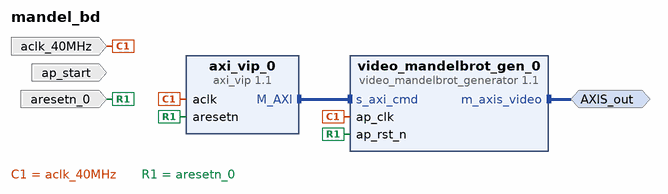
[diagram p0: block diagram of the top level]
# Vivado block design mandel_bd, xc7a35tcpg236-1, Vivado 2019.1
create_bd_design mandel_bd

create_bd_intf_port -mode Master -vlnv xilinx.com:interface:axis_rtl:1.0 AXIS_out
set_property -dict {CONFIG.FREQ_HZ 40000000} [get_bd_intf_ports AXIS_out]
create_bd_port -dir I -type clk aclk_40MHz
set_property -dict [list \
  CONFIG.ASSOCIATED_BUSIF AXIS_out \
  CONFIG.ASSOCIATED_RESET aresetn_0 \
  CONFIG.FREQ_HZ 40000000 \
] [get_bd_ports aclk_40MHz]
create_bd_port -dir I ap_start
create_bd_port -dir I -type rst aresetn_0

create_bd_cell -type ip -vlnv xilinx.com:ip:axi_vip:1.1 axi_vip_0
set_property -dict [list \
  CONFIG.ADDR_WIDTH 12 \
  CONFIG.DATA_WIDTH 32 \
  CONFIG.HAS_BRESP 1 \
  CONFIG.HAS_PROT 1 \
  CONFIG.HAS_RRESP 1 \
  CONFIG.HAS_WSTRB 1 \
  CONFIG.INTERFACE_MODE MASTER \
  CONFIG.PROTOCOL AXI4LITE \
  CONFIG.READ_WRITE_MODE READ_WRITE \
] [get_bd_cells axi_vip_0]
create_bd_cell -type ip -vlnv xilinx.com:hls:video_mandelbrot_generator:1.1 video_mandelbrot_gen_0

# ---- connections ----

connect_bd_intf_net [get_bd_intf_pins axi_vip_0/M_AXI] [get_bd_intf_pins video_mandelbrot_gen_0/s_axi_cmd]
connect_bd_intf_net [get_bd_intf_ports AXIS_out] [get_bd_intf_pins video_mandelbrot_gen_0/m_axis_video]
connect_bd_net [get_bd_ports aclk_40MHz] [get_bd_pins video_mandelbrot_gen_0/ap_clk] [get_bd_pins axi_vip_0/aclk]
connect_bd_net -net aresetn_0_1 [get_bd_ports aresetn_0] [get_bd_pins video_mandelbrot_gen_0/ap_rst_n] [get_bd_pins axi_vip_0/aresetn]

# ---- address map ----
assign_bd_address -offset 0x000 -range 4K -target_address_space [get_bd_addr_spaces axi_vip_0/Master_AXI] [get_bd_addr_segs video_mandelbrot_gen_0/s_axi_cmd/Reg]

validate_bd_design
save_bd_design
